# Altium schematic sheet InputBuffer.SchDoc
size A4; SheetNumber: 4; SheetTotal: 6
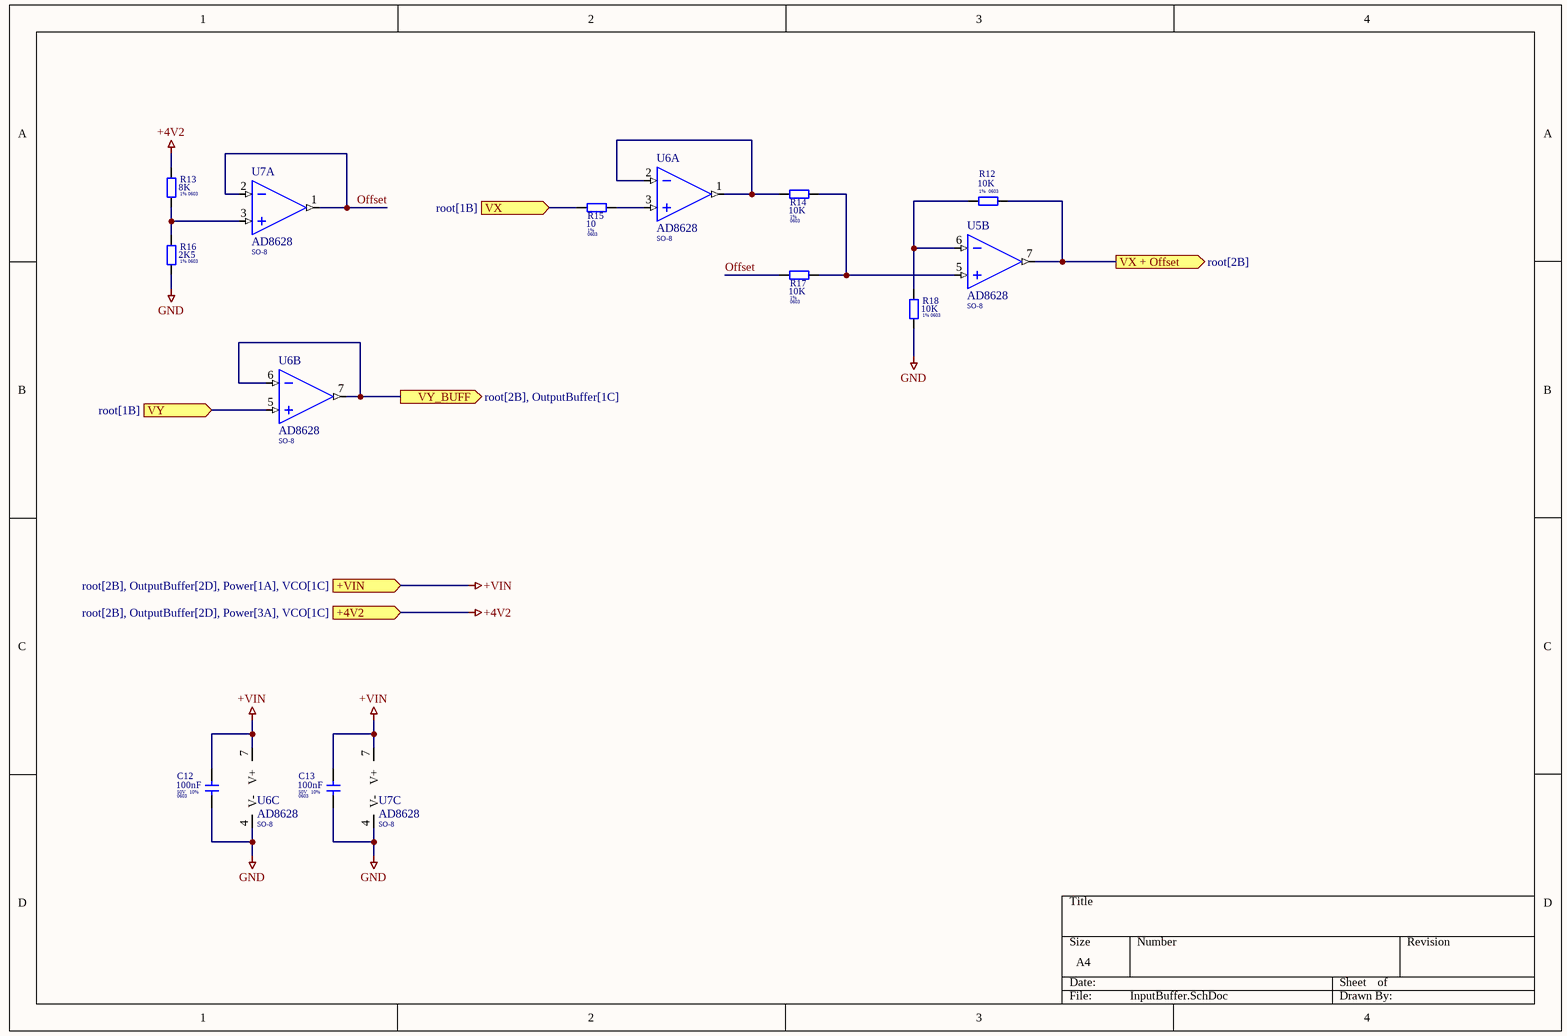
[diagram p0: InputBuffer.SchDoc]

## Parts
C12  value 100nF  Voltage: 50V  Tolerant: 10%  Package: 0603  [CAPC1608X06M]  (hidden comment: 100nF/50V)
C13  value 100nF  Voltage: 50V  Tolerant: 10%  Package: 0603  [CAPC1608X06M]  (hidden comment: 100nF/50V)
R12  value 10K  Package: 0603  Tolerance: 1%  [RESC1608X06L]  (hidden comment: 10K 1%)
R13  value 8K  Package: 0603  Tolerance: 1%  [RESC1608X06L]  (hidden comment: 8K 1%)
R14  value 10K  Package: 0603  Tolerance: 1%  [RESC1608X06L]  (hidden comment: 10K 1%)
R15  value 10  Package: 0603  Tolerance: 1%  [RESC1608X06L]  (hidden comment: 10 1%)
R16  value 2K5  Package: 0603  Tolerance: 1%  [RESC1608X06L]  (hidden comment: 2K5 1%)
R17  value 10K  Package: 0603  Tolerance: 1%  [RESC1608X06L]  (hidden comment: 10K 1%)
R18  value 10K  Package: 0603  Tolerance: 1%  [RESC1608X06L]  (hidden comment: 10K 1%)
U5  Package: SO-8  [SOIC127P600X170-8N]  (hidden comment: AD8628)  (part B of 3)
U6  Package: SO-8  [SOIC127P600X170-8N]  (hidden comment: AD8628)  (parts A,B,C of 3)
U7  Package: SO-8  [SOIC127P600X170-8N]  (hidden comment: AD8628)  (parts A,C of 3)

## Ports
+4V2 (in, see root[2B], OutputBuffer[2D], Power[3A], VCO[1C]), +VIN (in, see root[2B], OutputBuffer[2D], Power[1A], VCO[1C]), VX (in, see root[1B]), VX + Offset (out, see root[2B]), VY (in, see root[1B]), VY_BUFF (out, see root[2B], OutputBuffer[1C])

## Nets
+4V2: R13.2 ; port +4V2
+VIN: C12.2 C13.2 U6.7(V+) U7.7(V+) ; port +VIN
GND: C12.1 C13.1 R16.1 R18.1 U6.4(V-) U7.4(V-)
Offset: R17.1 U7.1(OUT) U7.2(IN-)
VX: R15.1 ; port VX
VX + Offset: R12.2 U5.7(OUT) ; port VX + Offset
VY: U6.5(IN+) ; port VY
VY_BUFF: U6.6(IN-) U6.7(OUT) ; port VY_BUFF
NetR12_1: R12.1 R18.2 U5.6(IN-)
NetR13_1: R13.1 R16.2 U7.3(IN+)
NetR14_1: R14.1 U6.1(OUT) U6.2(IN-)
NetR14_2: R14.2 R17.2 U5.5(IN+)
NetR15_2: R15.2 U6.3(IN+)

## Library data of the parts
C12 C13 = C
R12-R18 = R
U5-U7 = AD8628ARZ: Zero-Drift, Single-Supply, Rail-to-Rail Input/Output Operational Amplifier; Manufacture: Analog; helpurl: https://www.analog.com/media/en/technical-documentation/data-sheets/ad8628-8629-8630.pdf; value: AD8628